# Altium schematic sheet GPS.SchDoc
size A4
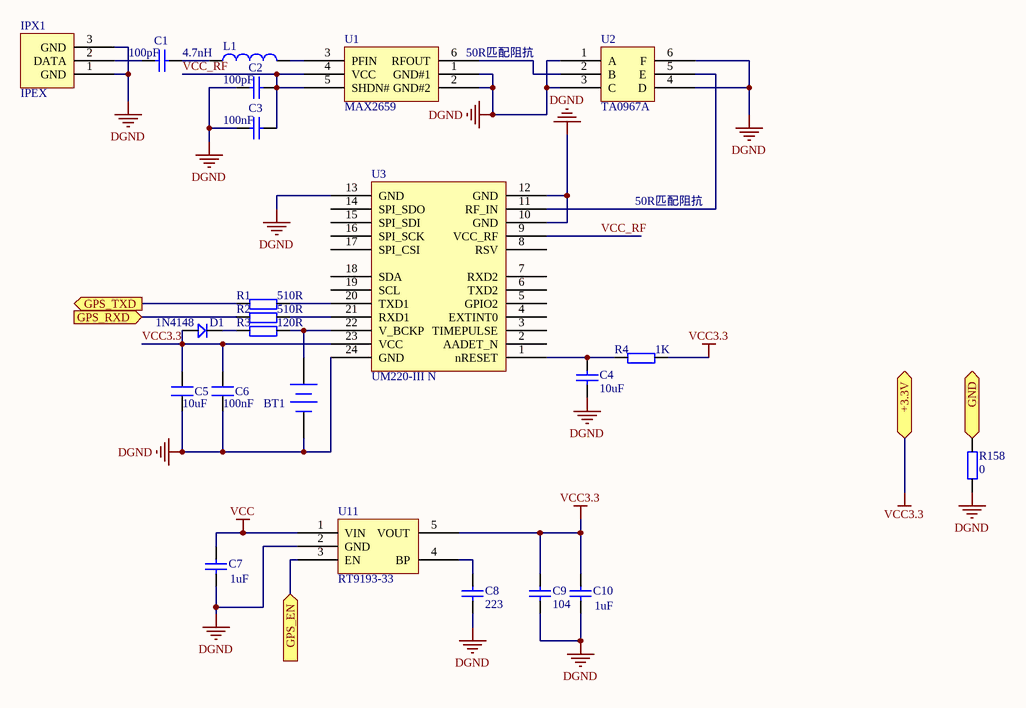
[diagram p0: GPS.SchDoc]

## Parts
BT1  Battery  [BAT]  (value not drawn)
C1  value 100pF  [0805]  (hidden comment: Cap)
C2  value 100pF  [0805]  (hidden comment: Cap)
C3  value 100nF  [0805]  (hidden comment: Cap)
C4  value 10uF  [0805]  (hidden comment: Cap)
C5  10uF  [0805]
C6  100nF  [0805]
C7  value 1uF  [0805]  (hidden comment: Cap)
C8  value 223  [0805]  (hidden comment: Cap)
C9  value 104  [0805]  (hidden comment: Cap)
C10  value 1uF  [0805]  (hidden comment: Cap)
D1  1N4148  [LC-SOD-323]
IPX1  IPEX  [IPEX]
L1  value 4.7nH  [0805]  (hidden comment: Inductor)
R1  510R  [0805]
R2  510R  [0805]
R3  120R  [0805]
R4  1K  [0805]
R158  0  [0805]
U1  MAX2659  [LC-uDFN-6]
U2  TA0967A  [TA0967A]
U3  UM220-III N  [UM220-III N]
U11  RT9193-33  [RT9193-33]

## Ports
+3.3V, GND, GPS_EN (in), GPS_RXD (in), GPS_TXD (out)

## Nets
DGND: BT1.2(-) C2.1 C3.1 C4.1 C5.1 C6.1 C7.1 C8.1 C9.1 C10.1 IPX1.1(GND) IPX1.3(GND) R158.1 U1.1(GND#1) U1.2(GND#2) U2.1(A) U2.3(C) U2.4(D) U2.6(F) U3.10(GND) U3.12(GND) U3.13(GND) U3.24(GND) U11.2(GND)
VCC: C7.2 U11.1(VIN)
VCC3.3: C5.2 C6.2 C9.2 C10.2 D1.1 R4.2 U3.23(VCC) U11.5(VOUT) ; port +3.3V
GND: R158.2 ; port GND
GPS_EN: U11.3(EN) ; port GPS_EN
GPS_RXD: R2.1 ; port GPS_RXD
GPS_TXD: R1.1 ; port GPS_TXD
VCC_RF: C2.2 C3.2 U1.4(VCC) U1.5(SHDN#) U3.9(VCC_RF)
NetBT1_1: BT1.1(+) R3.2 U3.22(V_BCKP)
NetC1_1: C1.1 IPX1.2(DATA)
NetC1_2: C1.2 L1.1
NetC4_2: C4.2 R4.1 U3.1(nRESET)
NetC8_2: C8.2 U11.4(BP)
NetD1_2: D1.2 R3.1
NetL1_2: L1.2 U1.3(PFIN)
NetR1_2: R1.2 U3.20(TXD1)
NetR2_2: R2.2 U3.21(RXD1)
NetU1_6: U1.6(RFOUT) U2.2(B)
NetU2_5: U2.5(E) U3.11(RF_IN)

Not connected (* = marked no-connect by the designer): U3 2(AADET_N) 3(TIMEPULSE) 4(EXTINT0) 5(GPIO2) 6(TXD2) 7(RXD2) 8(RSV) 14(SPI_SDO) 15(SPI_SDI) 16(SPI_SCK) 17(SPI_CSI) 18(SDA) 19(SCL)

## Notes on the sheet
- (near U1) 50R匹配阻抗
- 50R匹配阻抗

## Library data of the parts
BT1 = Battery: Multicell Battery; Published: 24-Mar-1999; LatestRevisionDate: 17-Jul-2002; LatestRevisionNote: Re-released for DXP Platform.; PackageReference: BAT-2; Publisher: Altium Limited; PackageDescription: Battery; 2 Leads
C1-C4 C7-C10 = Cap: Capacitor; Published: 8-Jun-2000; LatestRevisionDate: 17-Jul-2002; LatestRevisionNote: Re-released for DXP Platform.; PackageReference: RAD-0.3; Publisher: Altium Limited; PackageDescription: Radial Cap, Thru-Hole; 2 Leads; 0.3 in Pin Spacing
C5 C6 = C
D1 = D
IPX1 = IPX
L1 = Inductor: Code_IEC: 1005; Published: 8-Jun-2000; LatestRevisionDate: 29-May-2009; LatestRevisionNote: IPC-7351 Footprint Added.; PackageReference: 0402-A; Publisher: Altium Limited; PackageDescription: Chip Inductor; Code_JEITA: 0402
R1-R4 R158 = R
U3 = Component_1